# Altium schematic sheet 1_Interface.SchDoc
size A4
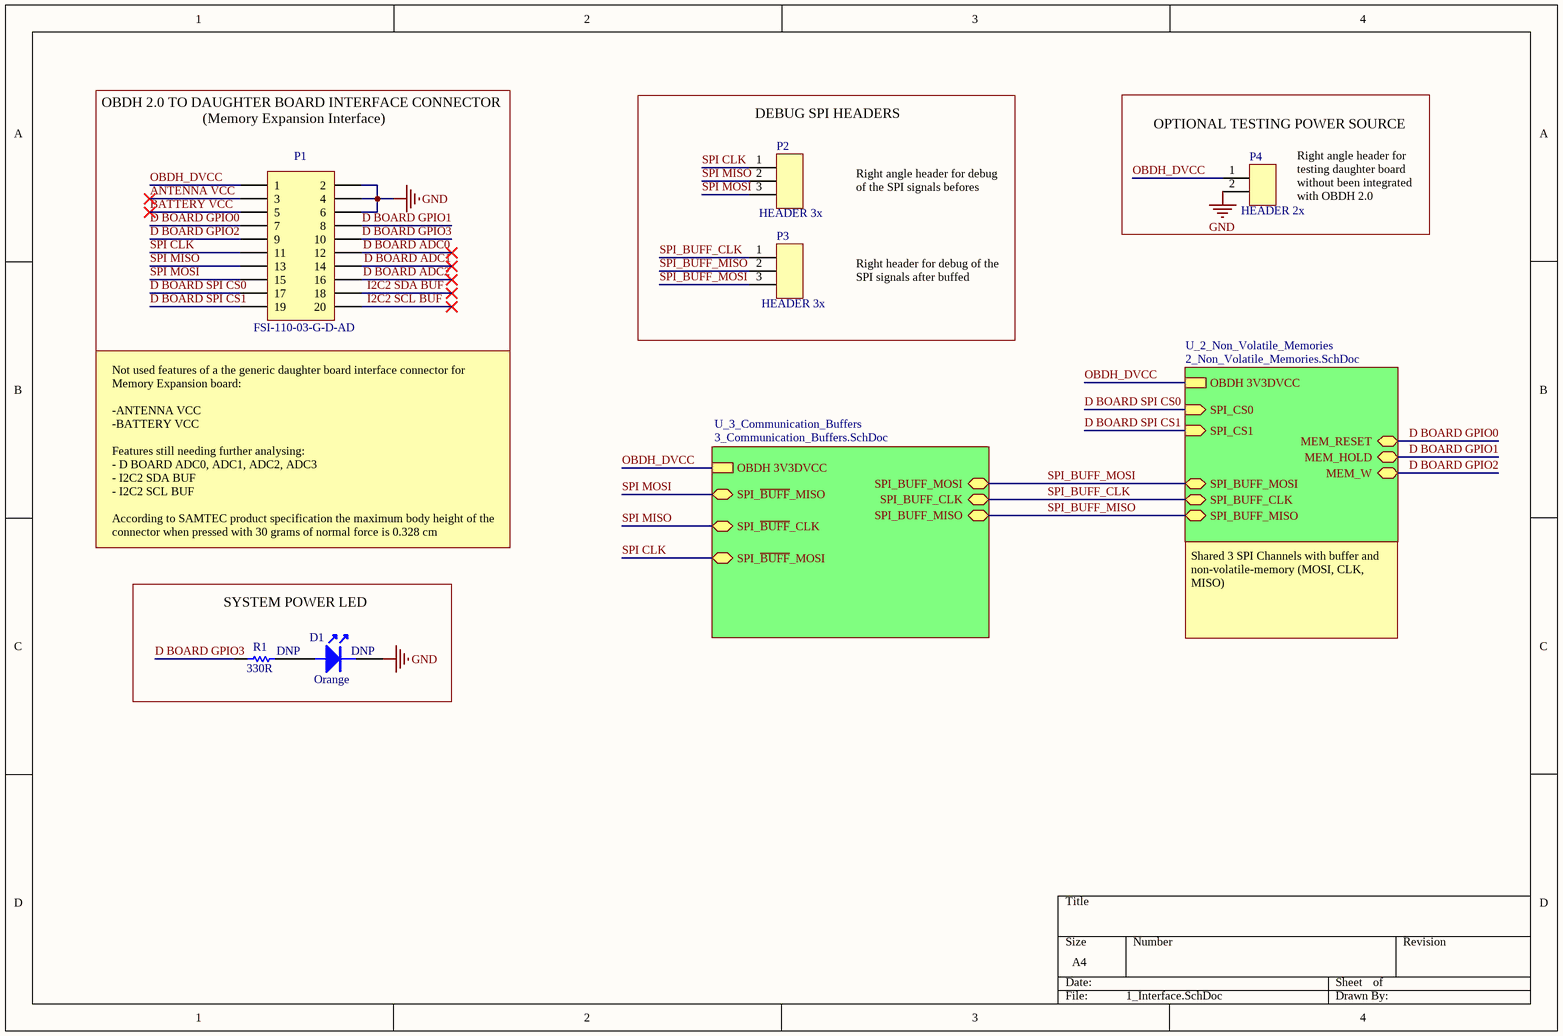
[diagram p0: 1_Interface.SchDoc]

## Parts
D1  Orange  [0805-LED]
P1  FSI-110-03-G-D-AD  [Mating FSI-110-03-G-D-AD]
P2  HEADER 3x  [Header1x3]
P3  HEADER 3x  [Header1x3]
P4  HEADER 2x  [HDR 1X2]
R1  330R  [0805]

## Blocks framed on the sheet
DEBUG SPI HEADERS: P2 P3
OPTIONAL TESTING POWER SOURCE: P4
SYSTEM POWER LED: D1 R1

## Sub-sheets
U_2_Non_Volatile_Memories = 2_Non_Volatile_Memories.SchDoc: SPI_CS1 (in), SPI_CS0 (in), MEM_RESET (bidir), MEM_HOLD (bidir), MEM_W (bidir), SPI_BUFF_MOSI (bidir), SPI_BUFF_CLK (bidir), SPI_BUFF_MISO (bidir), OBDH 3V3DVCC
U_3_Communication_Buffers = 3_Communication_Buffers.SchDoc: SPI_BUFF_MOSI (bidir), SPI_BUFF_CLK (bidir), SPI_BUFF_MISO (bidir), SPI_~{BUFF}_MISO (bidir), SPI_~{BUFF}_CLK (bidir), SPI_~{BUFF}_MOSI (bidir), OBDH 3V3DVCC

## Nets
GND: D1.2(K) P1.2 P1.4 P1.6 P4.2
ANTENNA VCC: P1.3
BATTERY VCC: P1.5
D BOARD ADC0: P1.12
D BOARD ADC1: P1.14
D BOARD ADC2: P1.16
D BOARD GPIO0: P1.7 ; sheet U_2_Non_Volatile_Memories/MEM_RESET
D BOARD GPIO1: P1.8 ; sheet U_2_Non_Volatile_Memories/MEM_HOLD
D BOARD GPIO2: P1.9 ; sheet U_2_Non_Volatile_Memories/MEM_W
D BOARD GPIO3: P1.10 R1.1
D BOARD SPI CS0: P1.17 ; sheet U_2_Non_Volatile_Memories/SPI_CS0
D BOARD SPI CS1: P1.19 ; sheet U_2_Non_Volatile_Memories/SPI_CS1
I2C2 SCL BUF: P1.20
I2C2 SDA BUF: P1.18
OBDH_DVCC: P1.1 P4.1 ; sheet U_2_Non_Volatile_Memories/OBDH 3V3DVCC, sheet U_3_Communication_Buffers/OBDH 3V3DVCC
SPI CLK: P1.11 P2.1 ; sheet U_3_Communication_Buffers/SPI_~{BUFF}_MOSI
SPI MISO: P1.13 P2.2 ; sheet U_3_Communication_Buffers/SPI_~{BUFF}_CLK
SPI MOSI: P1.15 P2.3 ; sheet U_3_Communication_Buffers/SPI_~{BUFF}_MISO
SPI_BUFF_CLK: P3.1 ; sheet U_2_Non_Volatile_Memories/SPI_BUFF_CLK, sheet U_3_Communication_Buffers/SPI_BUFF_CLK
SPI_BUFF_MISO: P3.2 ; sheet U_2_Non_Volatile_Memories/SPI_BUFF_MISO, sheet U_3_Communication_Buffers/SPI_BUFF_MISO
SPI_BUFF_MOSI: P3.3 ; sheet U_2_Non_Volatile_Memories/SPI_BUFF_MOSI, sheet U_3_Communication_Buffers/SPI_BUFF_MOSI
NetD1_1: D1.1(A) R1.2

## Notes on the sheet
- OBDH 2.0 TO DAUGHTER BOARD INTERFACE CONNECTOR
- (Memory Expansion Interface)
- Right angle header for debug of the SPI signals befores buffed
- (near P4) Right angle header for testing daughter board without been integrated with OBDH 2.0
- Right header for debug of the SPI signals after buffed
- Not used features of a the generic daughter board interface connector for Memory Expansion board:
  -ANTENNA VCC
  -BATTERY VCC
  Features still needing further analysing:
  - D BOARD ADC0, ADC1, ADC2, ADC3
  - I2C2 SDA BUF
  - I2C2 SCL BUF
  According to SAMTEC product specification the maximum body height of the connector when pressed with 30 grams of normal force is 0.328 cm
- (near R1) DNP
- (near D1) DNP
- Shared 3 SPI Channels with buffer and non-volatile-memory (MOSI, CLK, MISO)

## Library data of the parts
D1 = LED/R_0603: SMD Orange LED; Partnumber: LTST-C170KFKT; NCM: 8541.40.21
P2 P3 = TSW-103-08-G-S-RA: Conn Unshrouded Header HDR 3 POS 2.54mm Solder RA Thru-Hole Automotive Bulk; Manufacturer: Samtec; Number of Contacts: 3; Connector Type: Male Pin; Gender: Male; Max Current Rating: 7.6A; Max Voltage Rating (AC): 450V; Supplier 1: Digi-Key; Manufacturer Part Number: TSW-103-08-G-S-RA; Stock 1: 2118; Pricing 1: 1=0.43, 10=0.403, 25=0.3456, 50=0.2938, 100=0.2822, 250=0.25344, 500=0.24192 (USD); Contact Plating: Gold; Contact Material: Bronze; Color: Black; Housing Color: Black; Housing Material: Polyester; Min Operating Temperature: -55°C; Max Operating Temperature: 125°C; Number of Rows: 1; Termination: Solder; Packaging: Bulk; Number of Positions: 3; Package Quantity: 1; Orientation: Right Angle; Length: 7.62mm; Pitch: 2.54mm; Depth: 9.9mm; Contact Mating Length: 0.23inch; Width: 2.54mm; Radiation Hardening: No; REACH SVHC: No SVHC; Lead Free: Lead Free; ComponentLink1URL: http://www.samtec.com/ftppub/pdf/htsw_th.pdf?src-supplier=Avnet+Europe; ComponentLink1Description: http://www.samtec.com/ftppub/pdf/htsw_th.pdf?src-supplier=Avnet+Europe; ComponentLink2URL: http://www.samtec.com/ftppub/pdf/htsw_th.pdf?src-supplier=Avnet; ComponentLink2Description: http://www.samtec.com/ftppub/pdf/htsw_th.pdf?src-supplier=Avnet; ComponentLink3URL: http://suddendocs.samtec.com/prints/tsw-xxx-xx-x-x-xx-xxx-footprint.pdf?src-supplier=Digi-Key; ComponentLink3Description: http://suddendocs.samtec.com/prints/tsw-xxx-xx-x-x-xx-xxx-footprint.pdf?src-supplier=Digi-Key; Supplier Part Number 1: SAM1039-03-ND
P4 = HEADER 2x: Conn Unshrouded Header HDR 2 POS 2.54mm Solder RA Thru-Hole Automotive Bulk; Manufacturer: Samtec; Manufacturer Part Number: TSW-102-08-G-S-RA; Number of Positions: 2; Connector Type: Male Pin; Gender: Male; Max Current Rating: 7.6A; Max Voltage Rating (AC): 450V; Supplier 1: Digi-Key; Stock 1: 1298; Pricing 1: 1=0.28, 10=0.269, 25=0.2304, 50=0.1958, 100=0.1882, 250=0.16896, 500=0.16128 (USD); Contact Plating: Gold; Contact Material: Bronze; Color: Black; Housing Color: Black; Housing Material: Polyester; Min Operating Temperature: -55°C; Max Operating Temperature: 125°C; Number of Rows: 1; Termination: Solder; Packaging: Bulk; Number of Contacts: 2; Orientation: Right Angle; Package Quantity: 1; Length: 5.08mm; Pitch: 2.54mm; Width: 2.54mm; Depth: 9.9mm; Contact Mating Length: 0.23inch; Radiation Hardening: No; Lead Free: Lead Free; REACH SVHC: No SVHC; ComponentLink1URL: http://www.samtec.com/ftppub/pdf/htsw_th.pdf?src-supplier=Avnet; ComponentLink1Description: http://www.samtec.com/ftppub/pdf/htsw_th.pdf?src-supplier=Avnet; ComponentLink2URL: http://suddendocs.samtec.com/prints/tsw-xxx-xx-x-x-xx-xxx-footprint.pdf?src-supplier=Digi-Key; ComponentLink2Description: http://suddendocs.samtec.com/prints/tsw-xxx-xx-x-x-xx-xxx-footprint.pdf?src-supplier=Digi-Key; Supplier Part Number 1: SAM1039-02-ND
R1 = R330R_1%_1/4W_0805: RES 330R OHM 1/4W 1% 0805; Partnumber: RC0805FR-07330RL; NCM: 8533.21.20
P1 = FSI-110-03-G-D-AD: Value: *; Partnumber: FSI-110-03-G-D-AD